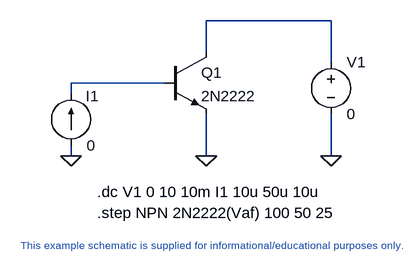
[diagram p0: schematic stepmodelparam.asc]
stepmodelparam.asc, the LTspice schematic file:
Version 4
SHEET 1 2252 1608
WIRE 1920 1200 1728 1200
WIRE 1728 1248 1728 1200
WIRE 1920 1264 1920 1200
WIRE 1664 1296 1520 1296
WIRE 1520 1312 1520 1296
WIRE 1520 1408 1520 1392
WIRE 1728 1408 1728 1344
WIRE 1920 1408 1920 1344
FLAG 1520 1408 0
FLAG 1728 1408 0
FLAG 1920 1408 0
SYMBOL npn 1664 1248 R0
SYMATTR InstName Q1
SYMATTR Value 2N2222
SYMBOL current 1520 1392 M180
WINDOW 0 23 76 Left 2
WINDOW 3 24 0 Left 2
SYMATTR InstName I1
SYMATTR Value 0
SYMBOL voltage 1920 1248 R0
WINDOW 39 0 0 Left 2
WINDOW 123 0 0 Left 2
SYMATTR InstName V1
SYMATTR Value 0
TEXT 1560 1464 Left 2 !.dc V1 0 10 10m I1 10u 50u 10u
TEXT 1560 1496 Left 2 !.step NPN 2N2222(Vaf) 100 50 25
TEXT 1728 1536 Top 1 ;This example schematic is supplied for informational/educational purposes only.

The netlist it stands for:
* stepmodelparam.asc
Q1 N001 N002 0 0 2N2222
I1 0 N002 0
V1 N001 0 0
.model NPN NPN
.model PNP PNP
.lib standard.bjt
.dc V1 0 10 10m I1 10u 50u 10u
.step NPN 2N2222(Vaf) 100 50 25
* This example schematic is supplied for informational/educational purposes only.
.backanno
.end